# Altium schematic sheet LED.SchDoc
size A4
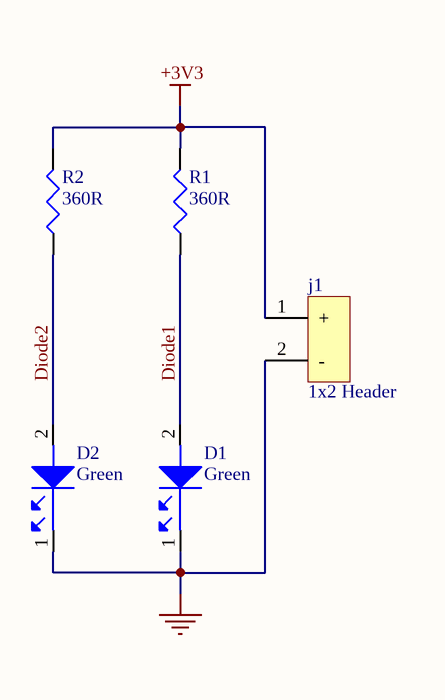
[diagram p0: LED.SchDoc]

## Parts
D1  Green  [LED0603_G]
D2  Green  [LED0603_G]
j1  1x2 Header  [HDR1X2]
R1  360R  [R0805]
R2  360R  [R0805]

## Nets
 +3V3: j1.1(+) R1.2 R2.2
GND: D1.1 D2.1 j1.2(-)
Diode1: D1.2 R1.1
Diode2: D2.2 R2.1

## Library data of the parts
D1 D2 = LNJ337W83RA: LED GREEN 0603 SMD; Manufacturer: Panasonic SSG; Color: Green,Yellow; Luminous Intensity: 7.5mcd; Forward Voltage: 1.95V; Wavelength: 572nm; Forward Current: 20mA; Power Rating: 55mW; Test Current: 5mA; Lens Style: Rectangular; Number of LEDs: 1; Reverse Voltage: 4V; Supplier 1: Farnell; Supplier Part Number 1: 1908053; Manufacturer Part Number: LNJ337W83RA; RoHS: Yes; Category: Optoeletronica; Pricing 1: 5=0,17800, 25=0,15100, 100=0,11700, 250=0,10100, 500=0,09170, 1000=0,08240 (GBP); Mount: Surface Mount; Case/Package: 0603; Number of Pins: 2; Case Code (Metric): 1608; Case Code (Imperial): 0603; Min Operating Temperature: -30°C; Max Operating Temperature: 85°C; Package Quantity: 5000; Packaging: Cut Tape; Illumination Color: Green; Dominant Wavelength: 572nm; Series: LN; Max Power Dissipation: 55mW; Reverse Voltage (DC): 4V; Length: 1.6mm; Width: 0.8mm; Height: 0.2mm; Lead Free: Lead Free; RoHS Compliant: Yes; REACH SVHC: Yes; ComponentLink1URL: https://datasheet.ciiva.com/6868/lnj337w83ra-aek-6868817.pdf?src-supplier=Newark; ComponentLink1Description: https://datasheet.ciiva.com/6868/lnj337w83ra-aek-6868817.pdf?src-supplier=Newark; ComponentLink2URL: https://datasheet.ciiva.com/4690/lnj337w83ra-aek-226051-4690026.pdf?src-supplier=Mouser; ComponentLink2Description: https://datasheet.ciiva.com/4690/lnj337w83ra-aek-226051-4690026.pdf?src-supplier=Mouser; ComponentLink3URL: https://datasheet.ciiva.com/11775/0900766b80f0a8bb-11775418.pdf?src-supplier=RSComponents; ComponentLink3Description: https://datasheet.ciiva.com/11775/0900766b80f0a8bb-11775418.pdf?src-supplier=RSComponents
j1 = 22-29-2021: KK 254 Wire-to-Board Header, Vertical, with Friction Lock, 2 Circuits, Gold (Au) Plating; Manufacturer: Molex; Supplier 1: RSComponents; Manufacturer Part Number: 22-29-2021; RoHS: Yes; Stock 1: 1170; Pricing 1: 5=0,59600, 125=0,33000, 500=0,26800, 2500=0,21200, 5000=0,17200 (USD); Supplier Part Number 1: 6701320; Parameter 1: *; Category: Connectors
R1 R2 = CRCW0805360RFKEA: Res Thick Film 0805 360 Ohm 1% 1/8W ±100ppm/°C Molded SMD SMD Paper T/R; Manufacturer: Vishay; Number of Terminals/Pins: 2; Max Power Dissipation: 125mW; Voltage Rating (DC): 150V; Supplier 1: RSComponents; Supplier Part Number 1: 6791308; Manufacturer Part Number: CRCW0805360RFKEA; RoHS: Yes; Category: SMD Resistors; Stock 1: 3350; Pricing 1: 50=0,09800, 500=0,09100, 1000=0,08200, 2000=0,07200, 4000=0,06400 (USD); Case/Package: 0805; Number of Pins: 2; Case Code (Metric): 2012; Case Code (Imperial): 0805; Contact Plating: Tin; Weight: 0.000194oz; Min Operating Temperature: -55°C; Max Operating Temperature: 155°C; Resistance: 360R; Tolerance: 1%; Packaging: Cut Tape; Resistor Type: Thick Film; Package Quantity: 5000; Number of Terminations: 2; Temperature Coefficient: 100ppm/°C; Features: Automotive AEC-Q200; Power Rating: 125mW; Voltage Rating: 150V; Termination: SMD/SMT; Series: D/CRCW E3; Technology: THICK FILM; Length: 2mm; Width: 1.25mm; Height: 0.45mm; Depth: 1.25mm; Radiation Hardening: No; Lead Free: Lead Free; REACH SVHC: Unknown; Military Standard: Not; RoHS Compliant: Yes; ComponentLink1URL: https://datasheet.ciiva.com/2467/dcrcwe3-2467773.pdf?src-supplier=Digi-Key; ComponentLink1Description: https://datasheet.ciiva.com/2467/dcrcwe3-2467773.pdf?src-supplier=Digi-Key